# EAGLE design lcd_duffle_pth_mk_1 (EAGLE 6.5.0)
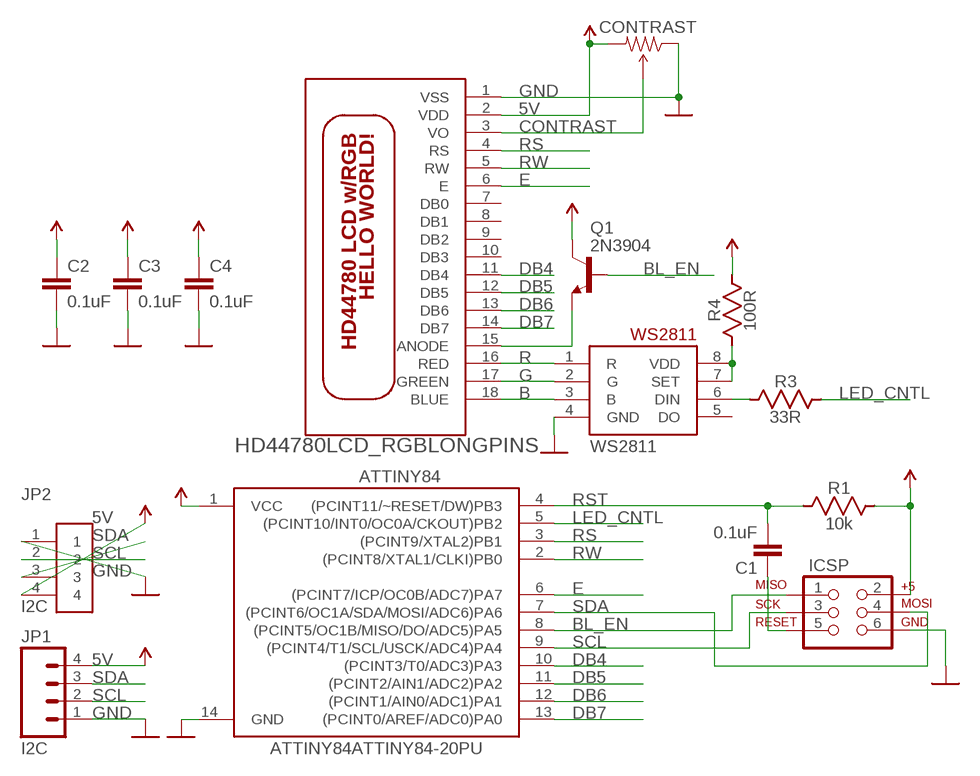
[diagram p0: schematic, sheet 1]

## Parts
ATTINY84  ATTINY84ATTINY84-20PU  [DIL14]
C1  0.1uF  CAPACITOR-CERAMIC025-024X044  [C025-024X044]
C2  0.1uF  CAPACITOR-CERAMIC025-024X044  [C025-024X044]
C3  0.1uF  CAPACITOR-CERAMIC025-024X044  [C025-024X044]
C4  0.1uF  CAPACITOR-CERAMIC025-024X044  [C025-024X044]
CONTRAST  TRIMPOT3362U-2  [3362U-2]
ICSP  AVR_SPI_PRG_6PTH  [2X3]
JP1  I2C  M04POLAR  [MOLEX-1X4]
JP2  I2C  1X4-BIG  [1X04-BIG]
Q1  2N3904  TRANSISTOR_NPNTO-92-AMMO  [TO-92-AMMO]
R1  10k  RESISTOR_PTH_0.2  [AXIAL-PTH-5.08MM]
R3  33R  RESISTOR_PTH_0.2  [AXIAL-PTH-5.08MM]
R4  100R  RESISTOR_PTH_0.2  [AXIAL-PTH-5.08MM]
U$1  HD44780LCD_RGBLONGPINS  [LCD1602-RGB]
WS2811  WS2811-SOP8  [SO08-SKINNYPADS]

## Nets
5V: ATTINY84.1(VCC) C2.2 C3.2 C4.2 CONTRAST.3(CW) ICSP.2 JP1.4 JP2.4 Q1.3(C) R1.P$1 R4.P$1 U$1.2(VDD)
B: U$1.18(BLUE) WS2811.3(B)
BL_EN: ATTINY84.8((PCINT5/OC1B/MISO/DO/ADC5)PA5) ICSP.1 Q1.2(B)
CONTRAST: CONTRAST.2(WIPER) U$1.3(VO)
DB4: ATTINY84.10((PCINT3/T0/ADC3)PA3) U$1.11(DB4)
DB5: ATTINY84.11((PCINT2/AIN1/ADC2)PA2) U$1.12(DB5)
DB6: ATTINY84.12((PCINT1/AIN0/ADC1)PA1) U$1.13(DB6)
DB7: ATTINY84.13((PCINT0/AREF/ADC0)PA0) U$1.14(DB7)
E: ATTINY84.6((PCINT7/ICP/OC0B/ADC7)PA7) U$1.6(E)
G: U$1.17(GREEN) WS2811.2(G)
GND: ATTINY84.14(GND) C2.1 C3.1 C4.1 CONTRAST.1(CCW) ICSP.6 JP1.1 JP2.1 U$1.1(VSS) WS2811.4(GND)
LED_CNTL: ATTINY84.5((PCINT10/INT0/OC0A/CKOUT)PB2) R3.P$1
N$1: R3.P$2 WS2811.6(DIN)
N$2: R4.P$2 WS2811.7(SET) WS2811.8(VDD)
N$3: C1.1 ICSP.5
N$4: Q1.1(E) U$1.15(ANODE)
R: U$1.16(RED) WS2811.1(R)
RS: ATTINY84.3((PCINT9/XTAL2)PB1) U$1.4(RS)
RST: ATTINY84.4((PCINT11/~RESET/DW)PB3) C1.2 R1.P$2
RW: ATTINY84.2((PCINT8/XTAL1/CLKI)PB0) U$1.5(RW)
SCL: ATTINY84.9((PCINT4/T1/SCL/USCK/ADC4)PA4) ICSP.3 JP1.2 JP2.2
SDA: ATTINY84.7((PCINT6/OC1A/SDA/MOSI/ADC6)PA6) ICSP.4 JP1.3 JP2.3
Unconnected: U$1.7(DB0) U$1.8(DB1) U$1.9(DB2) U$1.10(DB3) WS2811.5(DO)

## Library data of the parts
ATTINY84 = SparkFun-DigitalIC:ATTINY84: Atmel 14-pin 2/4/8kB flash uC
C1-C4 = butts:CAPACITOR-CERAMIC: CAPACITOR, European symbol
CONTRAST = SparkFun-Electromechanical:TRIMPOT: Various small potentiometers for "set-and-forget" applications
ICSP = SparkFun-Connectors:AVR_SPI_PRG_6: AVR ISP 6 Pin This is the reduced ISP connector for AVR programming. Common on Arduino. This footprint will take up less PCB space and can be used with a 10-pin to 6-pin adapter such as SKU: BOB-08508 **Special note about "TEST_POINT" package. The stop mask is on the top side, so if you want your programming test points to be on the bottom of your board, make sure to place this package on the bottom side of the board. This also ensure that the orientation to program from the bottom side will be correct.
JP1 = SparkFun-Connectors:M04: Header 4 Standard 4-pin 0.1" header. Use with straight break away headers (SKU : PRT-00116), right angle break away headers (PRT-00553), swiss pins (PRT-00743), machine pins (PRT-00117), and female headers (PRT-00115). Molex polarized connector foot print use with SKU : PRT-08231 with associated crimp pins and housings. 1MM SMD Version SKU: PRT-10208
JP2 = adafruit:1X4: 4-pin connector
Q1 = butts:TRANSISTOR_NPN: Generic NPN BJT MMBT2222A - TRANS-08049 (SOT-23, 1A 40V) MPSA42 - TRANS-09116 (SOT-23, 500mA 300V) MMBT5088LT1G - TRANS-11160 (SOT-23, 50 mA 30V) BC547 - COM-08928 <http://www.sparkfun.com/products/8928> (TO-92 45V 100mA) (1.Collector 2.Base 3.Emitter) 2N3904 - COM-00521 <http://www.sparkfun.com/products/521> (TO-92 40V 200mA) (1.Emitter 2.Base 3.Collector) P2N2222A - COM-12852 <http://www.sparkfun.com/products/12852> (TO-92 40V 600mA) (1.Collector 2.Base 3.Emitter)
R1 R3 R4 = butts:RESISTOR_PTH_0.2
U$1 = adafruit:HD44780LCD_RGB
WS2811 = adafruit:WS2811

## Board
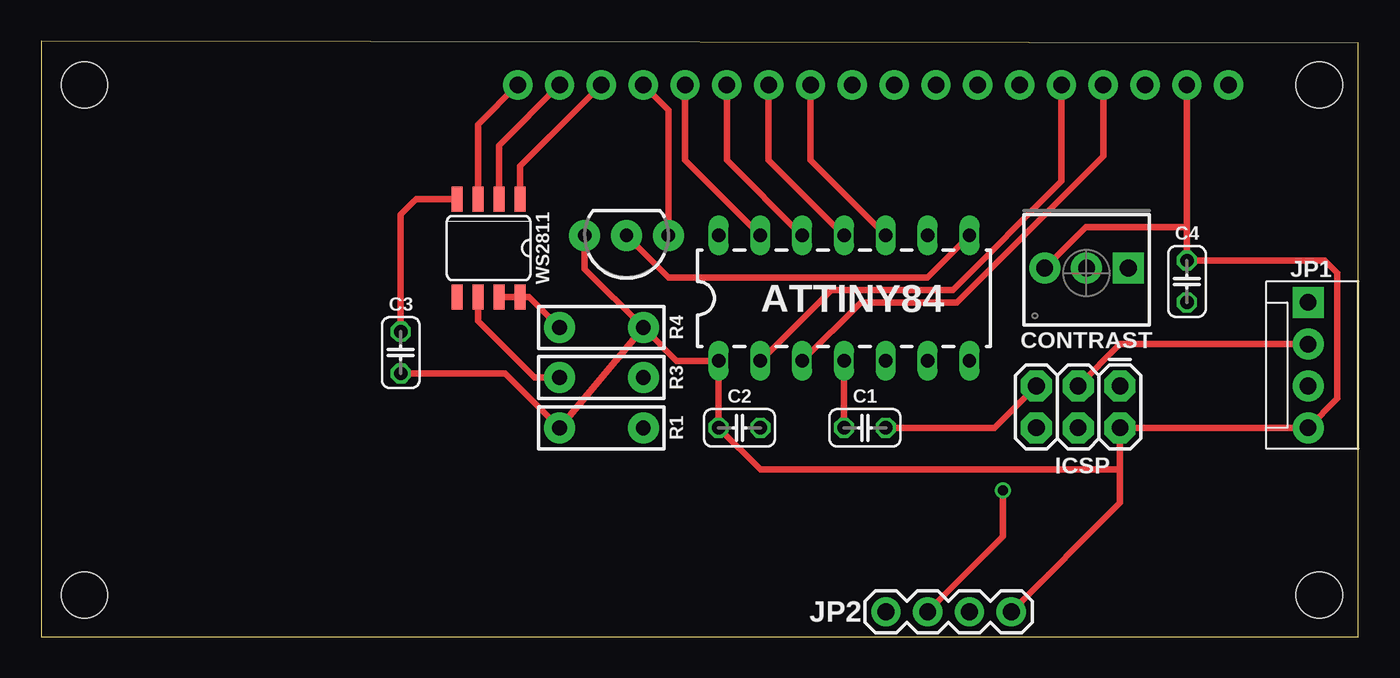
[diagram p1: board, top side]
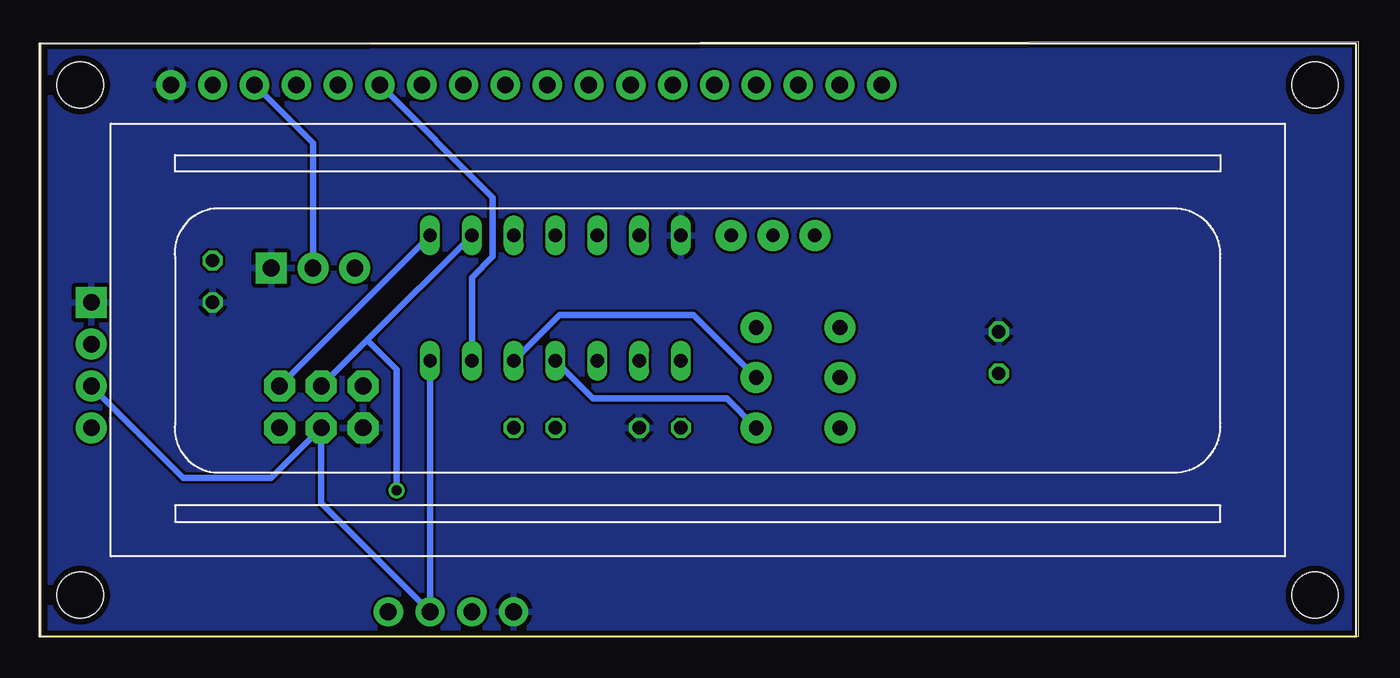
[diagram p2: board, bottom side, seen from below]

Size 80.01 x 36.2 mm. Coordinates in mm from the lower left corner, seen from the top.
Outline: 0,0 80.01,0 80.01,36.07 0,36.2 0,0
Copper layers (1*16): Top 0.0356mm / dielectric 1.5011mm / Bottom 0.0356mm
Design rules "LaenPCBOrder": minimum track width 6mil, minimum drill 13mil, track to track 6mil, track to pad 6mil, pad to pad 6mil, via to via 6mil, smd to smd 6mil, copper to edge 15mil, drill to drill 6mil, minimum pad ring 7mil, minimum via ring 7mil, stop-mask expansion 3mil, vias tented up to drill 0mil, thermal gap 10mil

### Footprints (pad centres in the part's own frame; a part is rotated, then mirrored left to right if it is on the bottom)
DIL14 = drill 0.813 long: 1 -8.89,-3.81; 2 -6.35,-3.81; 3 -3.81,-3.81; 4 -1.27,-3.81; 5 1.27,-3.81; 6 3.81,-3.81; 7 6.35,-3.81; 8 6.35,3.81; 9 3.81,3.81; 10 1.27,3.81; 11 -1.27,3.81; 12 -3.81,3.81; 13 -6.35,3.81; 14 -8.89,3.81
C025-024X044 = drill 0.813 octagon: 1 -1.27,0; 2 1.27,0
3362U-2 = drill 1.016 pad 1.88 square: 1 -2.54,-0.305 | drill 1.016 pad 1.88: 2 0,-0.305; 3 2.54,-0.305
2X3 = drill 1.016 pad 1.88 octagon: 1 0,0; 2 0,2.54; 3 2.54,0; 4 2.54,2.54; 5 5.08,0; 6 5.08,2.54
MOLEX-1X4 = drill 1.016 pad 1.88 square: 1 0,0 | drill 1.016 pad 1.88: 2 2.54,0; 3 5.08,0; 4 7.62,0
1X04-BIG = drill 1.016 pad 1.778: 1 0,0; 2 2.54,0; 3 5.08,0; 4 7.62,0
TO-92-AMMO = drill 0.813 pad 1.88: 1 -2.54,0; 2 0,0; 3 2.54,0
AXIAL-PTH-5.08MM = drill 0.9 pad 1.88: P$1 -2.54,0; P$2 2.54,0
LCD1602-RGB = drill 1 pad 1.778: 1 -32,15.5; 2 -29.46,15.5; 3 -26.92,15.5; 4 -24.38,15.5; 5 -21.84,15.5; 6 -19.3,15.5; 7 -16.76,15.5; 8 -14.22,15.5; 9 -11.68,15.5; 10 -9.14,15.5; 11 -6.6,15.5; 12 -4.06,15.5; 13 -1.52,15.5; 14 1.02,15.5; 15 3.56,15.5; 16 6.1,15.5; 17 8.64,15.5; 18 11.18,15.5 | hole 2.8: -37.5,-15.5; -37.5,15.5; 37.5,15.5; 37.5,-15.5
SO08-SKINNYPADS = smd 0.66 x 1.524: 1 -1.905,-2.973; 2 -0.635,-2.973; 3 0.635,-2.973; 4 1.905,-2.973; 5 1.905,2.973; 6 0.635,2.973; 7 -0.635,2.973; 8 -1.905,2.973

### Placement (x,y rotation side)
ATTINY84  50.04,20.57 0 top
C1  50.04,12.7 180 top
C2  42.42,12.7 180 top
C3  21.84,17.27 270 top
C4  69.6,21.59 90 top
CONTRAST  63.5,22.1 180 top
ICSP  65.53,15.24 180 top
JP1  76.96,20.32 270 top
JP2  51.31,1.52 0 top
Q1  35.56,24.38 180 top
R1  34.04,12.7 0 top
R3  34.04,15.75 180 top
R4  34.04,18.8 180 top
U$1  40.13,18.03 0 bottom
WS2811  27.18,23.62 180 top

### Tracks (layer width: path | path; a pad name or v marks a point on that pad's centre or on a via)
5V
  Top 0.406: C3.2 28.19,16 R1.P$1 R4.P$1 | R4.P$1 38.61,16.76 ATTINY84.1 C2.2 43.69,10.16 65.53,10.16 | 69.6,24.89 C4.2 77.98,22.86 78.74,22.1 78.74,14.48 JP1.4 ICSP.2 65.53,10.16 | 69.6,24.89 U$1.2 | CONTRAST.3 63.45,24.89 69.6,24.89 | JP2.4 65.53,8.13 65.53,10.16 | Q1.3 33.02,22.35 R4.P$1
B
  Top 0.406: U$1.18 26.54,31.12 WS2811.3
BL_EN
  Top 0.406: Q1.2 38.1,21.84 53.85,21.84 ATTINY84.8
  Bottom 0.406: ATTINY84.8 ICSP.1
CONTRAST
  Bottom 0.406: CONTRAST.2 63.5,29.98 U$1.3
DB4
  Top 0.406: U$1.11 46.73,28.96 ATTINY84.10
DB5
  Top 0.406: U$1.12 44.19,28.96 ATTINY84.11
DB6
  Top 0.406: U$1.13 41.65,28.96 ATTINY84.12
DB7
  Top 0.406: U$1.14 39.11,28.96 ATTINY84.13
E
  Bottom 0.406: ATTINY84.6 53.85,21.84 52.58,23.11 52.58,26.68 U$1.6
G
  Top 0.406: U$1.17 27.81,29.86 WS2811.2
GND
  Top 0.406: WS2811.4 22.79,26.59 21.84,25.65 C3.1
  pour Bottom: 0,0 0,36.2 80.26,36.2 80.26,0
LED_CNTL
  Bottom 0.406: R3.P$1 40.39,19.56 48.51,19.56 ATTINY84.5
N$1
  Top 0.406: R3.P$2 29.97,15.75 26.54,19.18 WS2811.6
N$2
  Top 0.406: WS2811.7 WS2811.8 29.64,20.65 R4.P$2
N$3
  Top 0.406: ICSP.5 57.91,12.7 C1.1
N$4
  Top 0.406: U$1.15 38.1,32.01 Q1.1
R
  Top 0.406: U$1.16 29.08,28.59 WS2811.1
RS
  Top 0.406: ATTINY84.3 49.78,20.32 55.63,20.32 64.51,29.21 U$1.4
RST
  Top 0.406: C1.2 ATTINY84.4
  Bottom 0.406: R1.P$2 38.35,14.48 46.48,14.48 ATTINY84.4
RW
  Top 0.406: ATTINY84.2 48.01,21.08 55.37,21.08 61.97,27.68 U$1.5
SCL  (via drill 0.6)
  Top 0.406: JP1.2 65.53,17.78 ICSP.3 | JP2.2 58.42,6.1 v58.42,8.89
  Bottom 0.406: ATTINY84.9 60.2,18.03 | 60.2,18.03 ICSP.3 | 60.2,18.03 58.42,16.26 v58.42,8.89
SDA
  Bottom 0.406: JP1.3 71.37,9.65 66.04,9.65 ICSP.4 62.99,8.13 JP2.3 ATTINY84.7